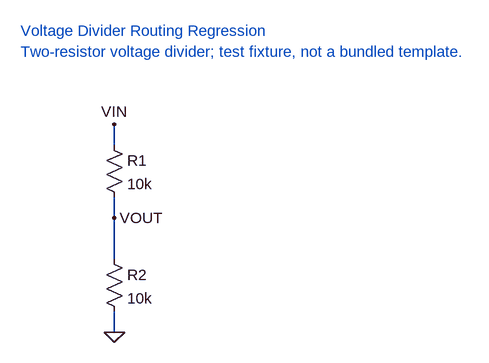
[diagram p0: schematic voltage_divider.asc]
voltage_divider.asc, the LTspice schematic file:
Version 4
SHEET 1 1200 800
TEXT 16 16 Left 2 ;Voltage Divider Routing Regression
TEXT 16 48 Left 2 ;Two-resistor voltage divider; test fixture, not a bundled template.
SYMBOL res 144 176 R0
SYMATTR InstName R1
SYMATTR Value 10k
SYMBOL res 144 352 R0
SYMATTR InstName R2
SYMATTR Value 10k
FLAG 160 160 VIN
WIRE 160 160 160 192
FLAG 160 304 VOUT
WIRE 160 272 160 304
WIRE 160 304 160 336
WIRE 160 336 160 368
FLAG 160 480 0
WIRE 160 448 160 480

The netlist it stands for:
* voltage_divider.asc
R1 VIN VOUT 10k
R2 VOUT 0 10k
* Voltage Divider Routing Regression
* Two-resistor voltage divider; test fixture, not a bundled template.
.backanno
.end